# Altium schematic sheet Sweet4x4_02.SchDoc: Sweet 4x4
size A3; Date: 14/06/2024; DrawnBy: Wim Van Gool; DocumentNumber: 1; Revision: 02; SheetNumber: 1; SheetTotal: 1
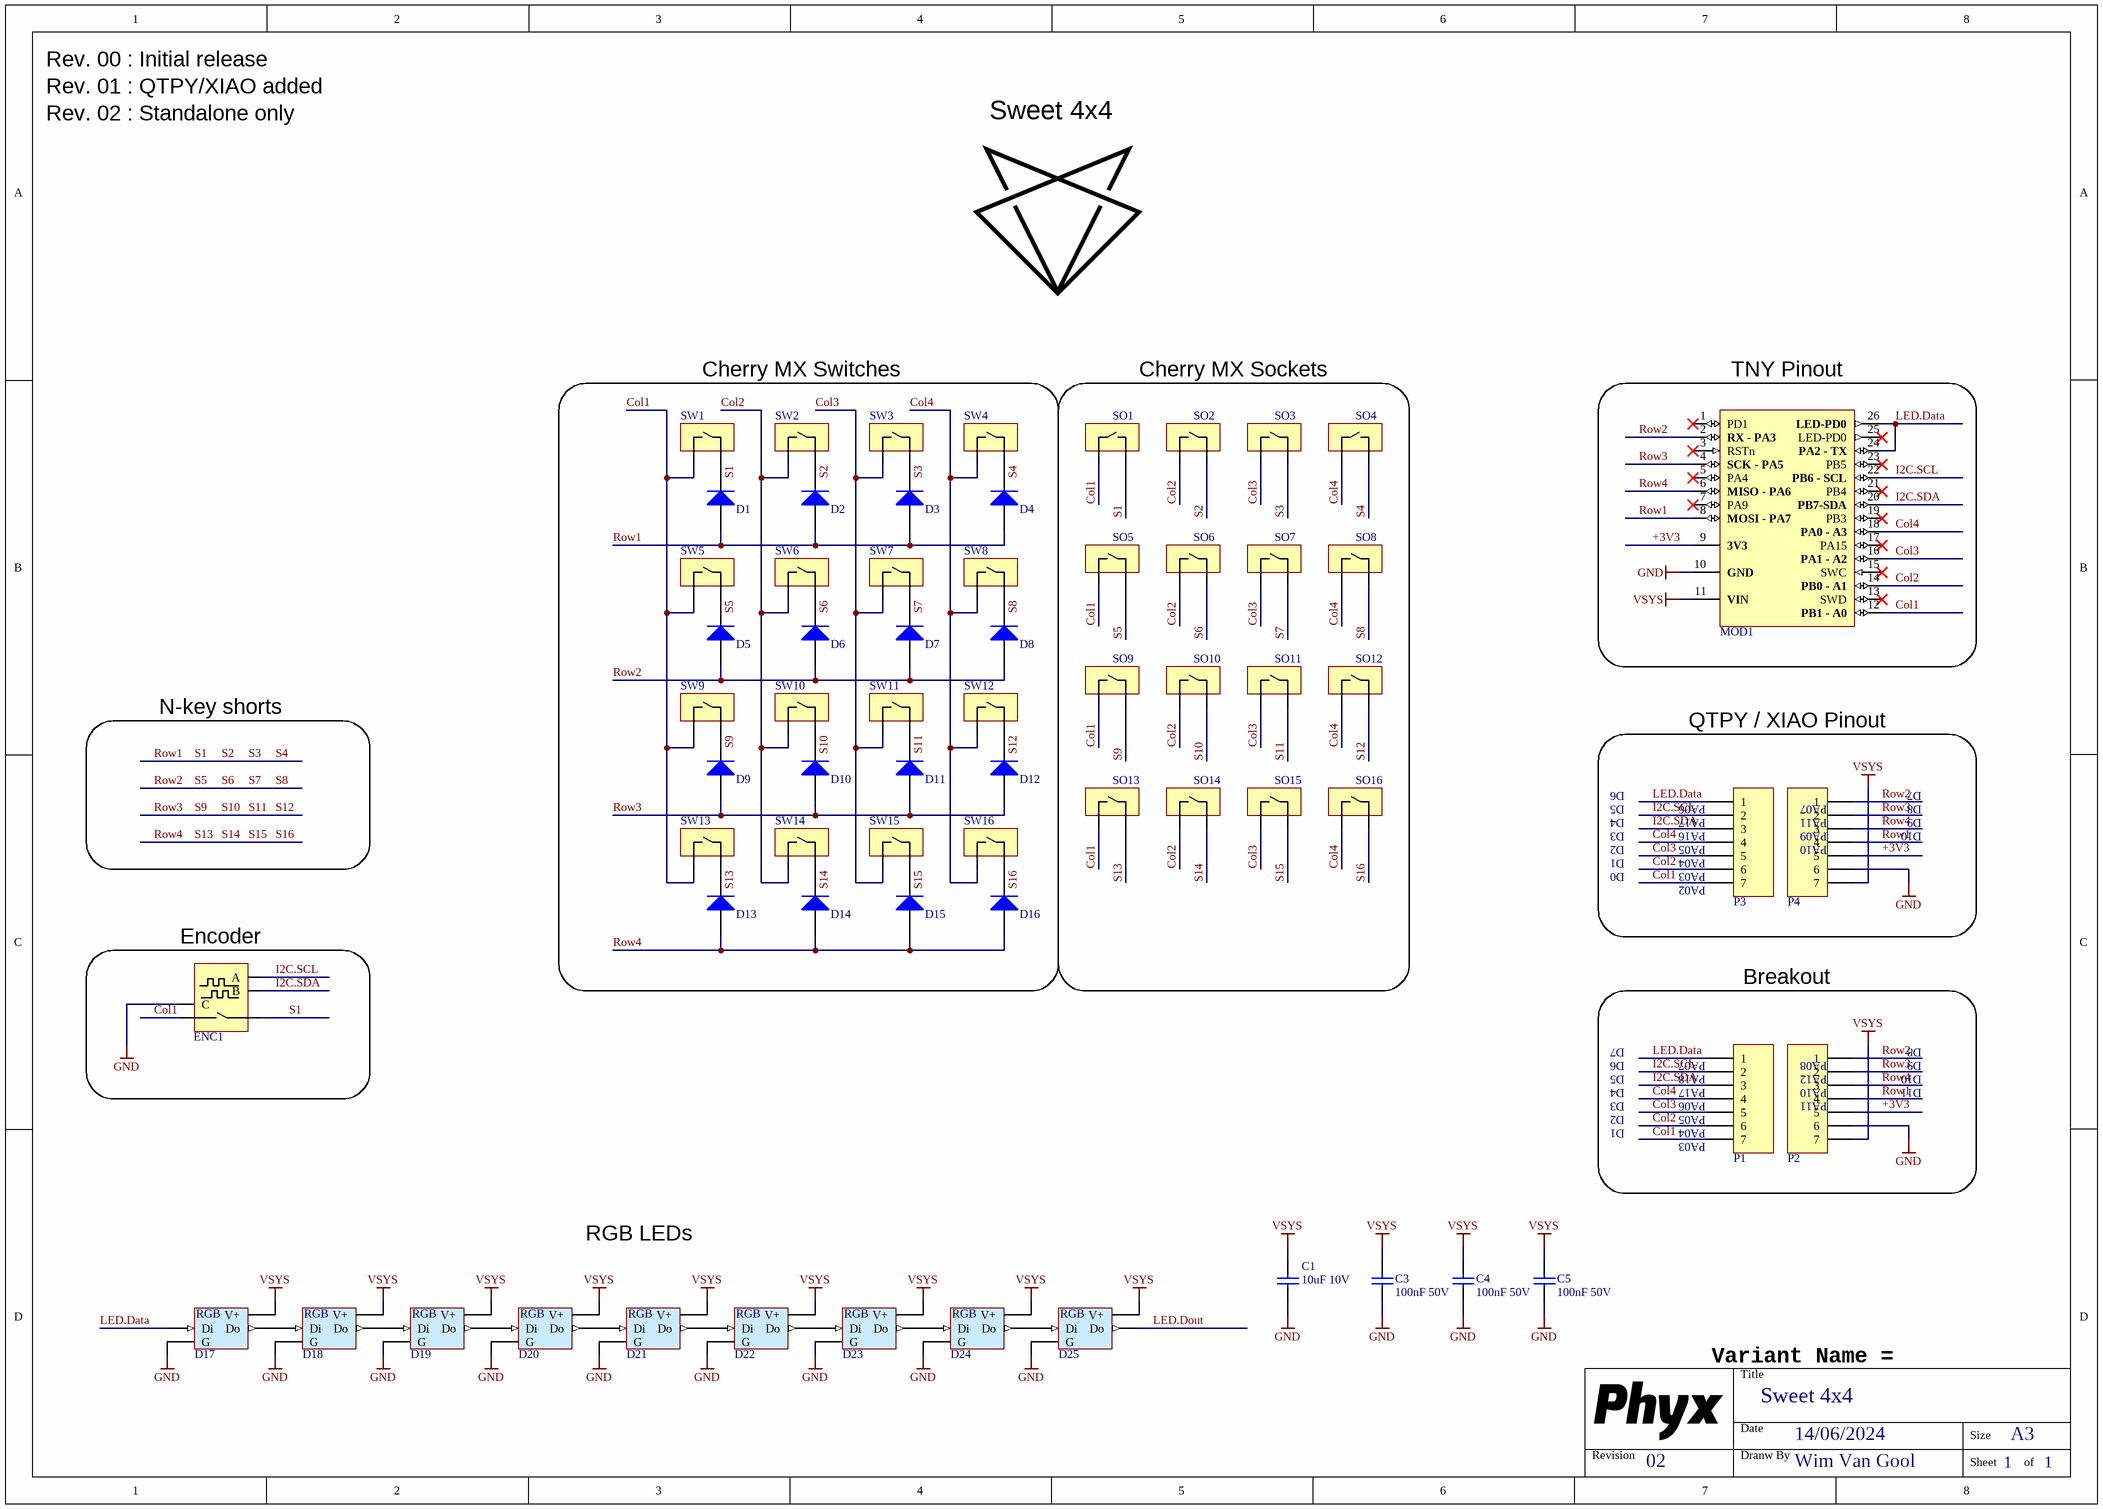
[diagram p0: Sweet4x4_02.SchDoc]

## Parts
C1  value 10uF 10V  [C0805_N]  (hidden comment: CAP_CERAMIC)
C3  value 100nF 50V  [C_5.08mm]  (hidden comment: CAP_CERAMIC)
C4  value 100nF 50V  [C_5.08mm]  (hidden comment: CAP_CERAMIC)
C5  value 100nF 50V  [C_5.08mm]  (hidden comment: CAP_CERAMIC)
D1  1N4148 100V 200mA 1Vf@10mA  [DO-35]  (value not drawn)
D2  1N4148 100V 200mA 1Vf@10mA  [DO-35]  (value not drawn)
D3  1N4148 100V 200mA 1Vf@10mA  [DO-35]  (value not drawn)
D4  1N4148 100V 200mA 1Vf@10mA  [DO-35]  (value not drawn)
D5  1N4148 100V 200mA 1Vf@10mA  [DO-35]  (value not drawn)
D6  1N4148 100V 200mA 1Vf@10mA  [DO-35]  (value not drawn)
D7  1N4148 100V 200mA 1Vf@10mA  [DO-35]  (value not drawn)
D8  1N4148 100V 200mA 1Vf@10mA  [DO-35]  (value not drawn)
D9  1N4148 100V 200mA 1Vf@10mA  [DO-35]  (value not drawn)
D10  1N4148 100V 200mA 1Vf@10mA  [DO-35]  (value not drawn)
D11  1N4148 100V 200mA 1Vf@10mA  [DO-35]  (value not drawn)
D12  1N4148 100V 200mA 1Vf@10mA  [DO-35]  (value not drawn)
D13  1N4148 100V 200mA 1Vf@10mA  [DO-35]  (value not drawn)
D14  1N4148 100V 200mA 1Vf@10mA  [DO-35]  (value not drawn)
D15  1N4148 100V 200mA 1Vf@10mA  [DO-35]  (value not drawn)
D16  1N4148 100V 200mA 1Vf@10mA  [DO-35]  (value not drawn)
D17  WS2812 based digital RGB LED 5mm Rectangle  [LED_5mm_RGB_RECT_EASY]  (value not drawn)
D18  WS2812 based digital RGB LED 5mm Rectangle  [LED_5mm_RGB_RECT_EASY]  (value not drawn)
D19  WS2812 based digital RGB LED 5mm Rectangle  [LED_5mm_RGB_RECT_EASY]  (value not drawn)
D20  WS2812 based digital RGB LED 5mm Rectangle  [LED_5mm_RGB_RECT_EASY]  (value not drawn)
D21  WS2812 based digital RGB LED 5mm Rectangle  [LED_5mm_RGB_RECT_EASY]  (value not drawn)
D22  WS2812 based digital RGB LED 5mm Rectangle  [LED_5mm_RGB_RECT_EASY]  (value not drawn)
D23  WS2812 based digital RGB LED 5mm Rectangle  [LED_5mm_RGB_RECT_EASY]  (value not drawn)
D24  WS2812 based digital RGB LED 5mm Rectangle  [LED_5mm_RGB_RECT_EASY]  (value not drawn)
D25  WS2812 based digital RGB LED 5mm Rectangle  [LED_5mm_RGB_RECT_EASY]  (value not drawn)
ENC1  Rotary Encoder with Switch  [PEC11-4215F-S0024]  (value not drawn)
MOD1  CH23V203 based TNY module  [PHYX_LANA_TNY_SMD]  (value not drawn)
P1  Header 7  [HDR1X7]  (value not drawn)
P2  Header 7  [HDR1X7]  (value not drawn)
P3  Header 7  [HDR1X7]  (value not drawn)
P4  Header 7  [HDR1X7]  (value not drawn)
SO1  Kailh MX Socket  [Kailh_MX_Socket]  (value not drawn)
SO2  Kailh MX Socket  [Kailh_MX_Socket]  (value not drawn)
SO3  Kailh MX Socket  [Kailh_MX_Socket]  (value not drawn)
SO4  Kailh MX Socket  [Kailh_MX_Socket]  (value not drawn)
SO5  Kailh MX Socket  [Kailh_MX_Socket]  (value not drawn)
SO6  Kailh MX Socket  [Kailh_MX_Socket]  (value not drawn)
SO7  Kailh MX Socket  [Kailh_MX_Socket]  (value not drawn)
SO8  Kailh MX Socket  [Kailh_MX_Socket]  (value not drawn)
SO9  Kailh MX Socket  [Kailh_MX_Socket]  (value not drawn)
SO10  Kailh MX Socket  [Kailh_MX_Socket]  (value not drawn)
SO11  Kailh MX Socket  [Kailh_MX_Socket]  (value not drawn)
SO12  Kailh MX Socket  [Kailh_MX_Socket]  (value not drawn)
SO13  Kailh MX Socket  [Kailh_MX_Socket]  (value not drawn)
SO14  Kailh MX Socket  [Kailh_MX_Socket]  (value not drawn)
SO15  Kailh MX Socket  [Kailh_MX_Socket]  (value not drawn)
SO16  Kailh MX Socket  [Kailh_MX_Socket]  (value not drawn)
SW1  Cherry MX Blue  [Cherry_MX1A]  (value not drawn)
SW2  Cherry MX Blue  [Cherry_MX1A]  (value not drawn)
SW3  Cherry MX Blue  [Cherry_MX1A]  (value not drawn)
SW4  Cherry MX Blue  [Cherry_MX1A]  (value not drawn)
SW5  Cherry MX Blue  [Cherry_MX1A]  (value not drawn)
SW6  Cherry MX Blue  [Cherry_MX1A]  (value not drawn)
SW7  Cherry MX Blue  [Cherry_MX1A]  (value not drawn)
SW8  Cherry MX Blue  [Cherry_MX1A]  (value not drawn)
SW9  Cherry MX Blue  [Cherry_MX1A]  (value not drawn)
SW10  Cherry MX Blue  [Cherry_MX1A]  (value not drawn)
SW11  Cherry MX Blue  [Cherry_MX1A]  (value not drawn)
SW12  Cherry MX Blue  [Cherry_MX1A]  (value not drawn)
SW13  Cherry MX Blue  [Cherry_MX1A]  (value not drawn)
SW14  Cherry MX Blue  [Cherry_MX1A]  (value not drawn)
SW15  Cherry MX Blue  [Cherry_MX1A]  (value not drawn)
SW16  Cherry MX Blue  [Cherry_MX1A]  (value not drawn)

## Blocks framed on the sheet
Cherry MX Switches: D1-D16 SW1-SW16
Cherry MX Sockets: SO1-SO16
TNY Pinout: MOD1
QTPY / XIAO Pinout: P3 P4
Encoder: ENC1
Breakout: P1 P2

## Nets
GND: C1.2 C3.2 C4.2 C5.2 D17.3(G) D18.3(G) D19.3(G) D20.3(G) D21.3(G) D22.3(G) D23.3(G) D24.3(G) D25.3(G) ENC1.C MOD1.10(GND) P2.6 P4.6
VSYS: C1.1 C3.1 C4.1 C5.1 D17.2(V+) D18.2(V+) D19.2(V+) D20.2(V+) D21.2(V+) D22.2(V+) D23.2(V+) D24.2(V+) D25.2(V+) MOD1.11(VIN) P2.7 P4.7
+3V3: MOD1.9(3V3) P2.5 P4.5
Col1: ENC1.1 MOD1.12(PB1_-_A0) P1.7 P3.7 SO1.2 SO5.1 SO9.1 SO13.1 SW1.1 SW5.1 SW9.1 SW13.1
Col2: MOD1.14(PB0_-_A1) P1.6 P3.6 SO2.1 SO6.1 SO10.1 SO14.1 SW2.1 SW6.1 SW10.1 SW14.1
Col3: MOD1.16(PA1_-_A2) P1.5 P3.5 SO3.1 SO7.1 SO11.1 SO15.1 SW3.1 SW7.1 SW11.1 SW15.1
Col4: MOD1.18(PA0_-_A3) P1.4 P3.4 SO4.2 SO8.1 SO12.1 SO16.1 SW4.1 SW8.1 SW12.1 SW16.1
I2C.SCL: ENC1.A MOD1.22(PB6_-_SCL) P1.2 P3.2
I2C.SDA: ENC1.B MOD1.20(PB7-SDA) P1.3 P3.3
LED.Data: D17.4(Di) MOD1.24(PA2_-_TX) MOD1.26(LED-PD0) P1.1 P3.1
LED.Dout: D25.1(Do)
Row1: D1.A D1.C D2.A D2.C D3.A D3.C D4.A D4.C ENC1.2 MOD1.8(MOSI_-_PA7) P2.4 P4.4 SO1.1 SO2.2 SO3.2 SO4.1 SW1.2 SW2.2 SW3.2 SW4.2  [also labelled S1, S2, S3, S4]
Row2: D5.A D5.C D6.A D6.C D7.A D7.C D8.A D8.C MOD1.2(RX_-_PA3) P2.1 P4.1 SO5.2 SO6.2 SO7.2 SO8.2 SW5.2 SW6.2 SW7.2 SW8.2  [also labelled S5, S6, S7, S8]
Row3: D9.A D9.C D10.A D10.C D11.A D11.C D12.A D12.C MOD1.4(SCK_-_PA5) P2.2 P4.2 SO9.2 SO10.2 SO11.2 SO12.2 SW9.2 SW10.2 SW11.2 SW12.2  [also labelled S10, S11, S12, S9]
Row4: D13.A D13.C D14.A D14.C D15.A D15.C D16.A D16.C MOD1.6(MISO_-_PA6) P2.3 P4.3 SO13.2 SO14.2 SO15.2 SO16.2 SW13.2 SW14.2 SW15.2 SW16.2  [also labelled S13, S14, S15, S16]
NetD17_1: D17.1(Do) D18.4(Di)
NetD18_1: D18.1(Do) D19.4(Di)
NetD19_1: D19.1(Do) D20.4(Di)
NetD20_1: D20.1(Do) D21.4(Di)
NetD21_1: D21.1(Do) D22.4(Di)
NetD22_1: D22.1(Do) D23.4(Di)
NetD23_1: D23.1(Do) D24.4(Di)
NetD24_1: D24.1(Do) D25.4(Di)

Not connected (* = marked no-connect by the designer): MOD1 1(PD1)* 3(RSTn)* 5(PA4)* 7(PA9)* 13(SWD)* 15(SWC)* 17(PA15)* 19(PB3)* 21(PB4)* 23(PB5)* 25(LED-PD0)*

## Notes on the sheet
- Rev. 00 : Initial release
- Rev. 01 : QTPY/XIAO added
- Rev. 02 : Standalone only
- N-key shorts
- D6
- D7
- D1
- D2
- D3
- D4
- D5
- (near P3) PA04
- (near P3) PA05
- (near P3) PA06
- (near P3) PA16
- (near P3) PA17
- (near P4) PA07
- (near P4) PA09
- (near P4) PA10
- (near P4) PA11
- D8
- D9
- D10
- D0
- (near P3) PA02
- (near P3) PA03
- (near P1) PA07
- (near P2) PA08
- (near P1) PA04
- (near P1) PA05
- (near P1) PA06
- (near P1) PA17
- (near P1) PA18
- (near P2) PA10
- (near P2) PA11
- (near P2) PA12
- D11
- (near P1) PA03
- RGB LEDs
- Variant Name =
- Title
- Revision
- Date
- Dranw By
- Size
- A3
- Sheet
- of
- (in symbol LED RGB WS2812 5mm Rectangle) RGB

## Library data of the parts
C1 = CAP # 10uF 10V 0805: Capacitor Ceramic; Supplier 1: Farnell; Supplier Part Number 1: 2320859
C3-C5 = CAP 100nF 50V 5.08mm: Capacitor Ceramic; Supplier 1: LCSC; Supplier Part Number 1: C84772
D1-D16 = DIO 1N4148 DO-35: Default Diode; Value: 1N4148; Supplier 1: LCSC; Supplier Part Number 1: C14538; Supplier 2: LCSC; Supplier Part Number 2: C14516
D17-D25 = LED RGB WS2812 5mm Rectangle: =Description; Value: WS2812D-255; Supplier 1: LCSC; Description: LED RGB WS2812 5mm Rectangle; Supplier Part Number 1: C4154874
ENC1 = ENC ROT INC 24-24ppr SW: Value: PEC11-4215F-S0024; Supplier 1: Farnell; Supplier Part Number 1: 1653380
MOD1 = MOD # CH23V203 LANA TNY SMD: Value: LANA TNY; Supplier 1: Phyx; Supplier Part Number 1: LANA TNY
P1-P4 = Pin Header 2.54mm 7way
SO1-SO16 = SW # Socket MX Kailh: Value: CPG151101S11; Supplier 1: NovelKeys
SW1-SW16 = SW Cherry MX1A-E1NN Blue: Supplier 1: Digi-key; Supplier Part Number 1: CH196-ND; Value: MX1A-E1NN; Supplier 2: Mouser; Supplier Part Number 2: 540-MX1A-E1NN